# Altium schematic sheet Rajesh_Jasti_17978253_Lab1.SchDoc
size A; DrawnBy: Rajesh_Jasti; Revision: Prototype; SheetNumber: 1; SheetTotal: 1
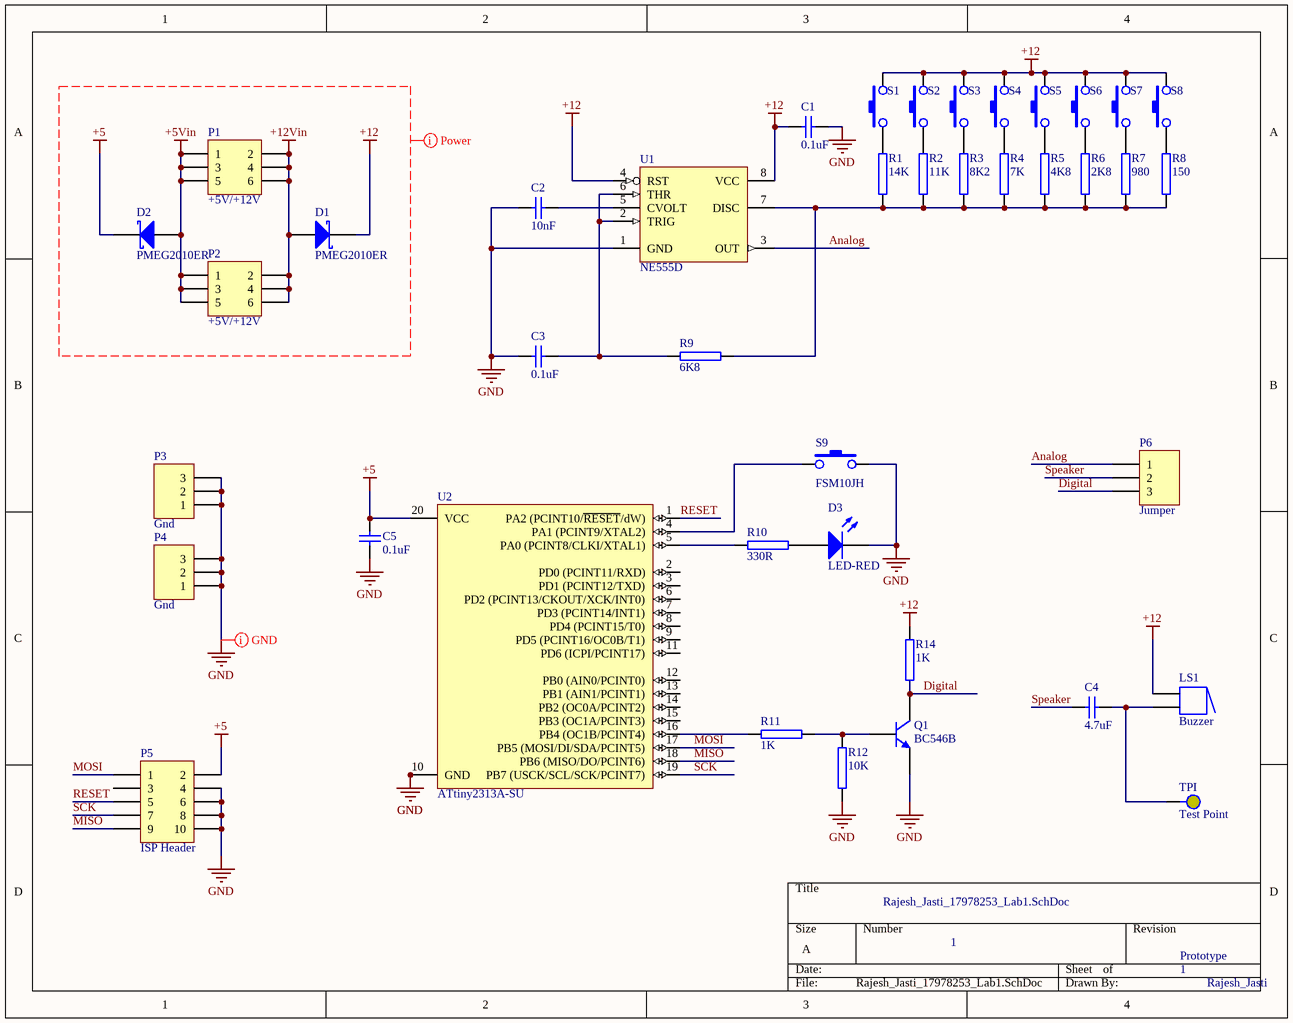
[diagram p0: Rajesh_Jasti_17978253_Lab1.SchDoc]

## Parts
C1  0.1uF  [CAP_1206]
C2  10nF  [CAP_1206]
C3  0.1uF  [CAP_1206]
C4  4.7uF  [CAP_1206]
C5  0.1uF  [CAP_1206]
D1  PMEG2010ER  [SOD123W]
D2  PMEG2010ER  [SOD123W]
D3  LED-RED  [LED1206R]
LS1  Buzzer  [Buzzer]
P1  +5V/+12V  [HDR2X3_AUT]
P2  +5V/+12V  [HDR2X3_AUT]
P3  Gnd  [HDR1X3_AUT]
P4  Gnd  [HDR1X3_AUT]
P5  ISP Header  [FKV10SN_AUT]
P6  Jumper  [HDR1X3_AUT]
Q1  BC546B  [TO-92AUT]
R1  14K  [AXIAL-0.3AUT]
R2  11K  [AXIAL-0.3AUT]
R3  8K2  [AXIAL-0.3AUT]
R4  7K  [AXIAL-0.3AUT]
R5  4K8  [AXIAL-0.3AUT]
R6  2K8  [AXIAL-0.3AUT]
R7  980  [AXIAL-0.3AUT]
R8  150  [AXIAL-0.3AUT]
R9  6K8  [AXIAL-0.3AUT]
R10  330R  [AXIAL-0.3AUT]
R11  1K  [AXIAL-0.3AUT]
R12  10K  [AXIAL-0.3AUT]
R14  1K  [AXIAL-0.3AUT]
S1  FSM10JH  [FSM10JH]  (value not drawn)
S2  FSM10JH  [FSM10JH]  (value not drawn)
S3  FSM10JH  [FSM10JH]  (value not drawn)
S4  FSM10JH  [FSM10JH]  (value not drawn)
S5  FSM10JH  [FSM10JH]  (value not drawn)
S6  FSM10JH  [FSM10JH]  (value not drawn)
S7  FSM10JH  [FSM10JH]  (value not drawn)
S8  FSM10JH  [FSM10JH]  (value not drawn)
S9  FSM10JH  [FSM10JH]
TPI  Test Point  [PAD1_AUT]
U1  NE555D  [SO8_M]
U2  ATtiny2313A-SU  [20S_M]

## Nets
+5: C5.2 D2.1(K) P5.2 U2.20(VCC)
+5Vin: D2.2(A) P1.1 P1.3 P1.5 P2.1 P2.3 P2.5
+12: C1.1 D1.1(K) LS1.1 R14.2 S1.2 S2.2 S3.2 S4.2 S5.2 S6.2 S7.2 S8.2 U1.4(RST) U1.8(VCC)
+12Vin: D1.2(A) P1.2 P1.4 P1.6 P2.2 P2.4 P2.6
GND: C1.2 C2.1 C3.1 C5.1 D3.K P3.1 P3.2 P3.3 P4.1 P4.2 P4.3 P5.4 P5.6 P5.8 P5.10 Q1.3(E) R12.1 S9.2 U1.1(GND) U2.10(GND)
Analog: P6.1 U1.3(OUT)
Digital: P6.3 Q1.1(C) R14.1
MISO: P5.9 U2.18(PB6_(MISO/DO/PCINT6))
MOSI: P5.1 U2.17(PB5_(MOSI/DI/SDA/PCINT5))
RESET: P5.5 U2.1(PA2_(PCINT10/~{RESET}/dW))
SCK: P5.7 U2.19(PB7_(USCK/SCL/SCK/PCINT7))
Speaker: C4.1 P6.2
NetC2_2: C2.2 U1.5(CVOLT)
NetC3_2: C3.2 R9.2 U1.2(TRIG) U1.6(THR)
NetC4_2: C4.2 LS1.2 TPI.1
NetD3_A: D3.A R10.1
NetQ1_2: Q1.2(B) R11.1 R12.2
NetR1_1: R1.1 R2.1 R3.1 R4.1 R5.1 R6.1 R7.1 R8.1 R9.1 U1.7(DISC)
NetR1_2: R1.2 S1.1
NetR2_2: R2.2 S2.1
NetR3_2: R3.2 S3.1
NetR4_2: R4.2 S4.1
NetR5_2: R5.2 S5.1
NetR6_2: R6.2 S6.1
NetR7_2: R7.2 S7.1
NetR8_2: R8.2 S8.1
NetR10_2: R10.2 U2.5(PA0_(PCINT8/CLKI/XTAL1))
NetR11_2: R11.2 U2.16(PB4_(OC1B/PCINT4))
NetS9_1: S9.1 U2.4(PA1_(PCINT9/XTAL2))

Not connected (* = marked no-connect by the designer): P5 3; U2 2(PD0_(PCINT11/RXD)) 3(PD1_(PCINT12/TXD)) 6(PD2_(PCINT13/CKOUT/XCK/INT0)) 7(PD3_(PCINT14/INT1)) 8(PD4_(PCINT15/T0)) 9(PD5_(PCINT16/OC0B/T1)) 11(PD6_(ICPI/PCINT17)) 12(PB0_(AIN0/PCINT0)) 13(PB1_(AIN1/PCINT1)) 14(PB2_(OC0A/PCINT2)) 15(PB3_(OC1A/PCINT3))

## Layout directives
rule Clearance Constraint [Clearance = 20mil]; rule Width Constraint [Pref Width = 80mil    Min Width = 30mil    Max Width = 80mil]; rule Routing Via Style [Pref Size = 50mil    Pref Hole Size = 28mil]: +5, +5Vin, +12, +12Vin
mark named GND: GND

## Library data of the parts
C1-C5 = CAPN 1206: Non Polarized Capacitor, SMD, 1206
D1 D2 = PMEG2010ER: Schottky REC, 20V, 1A, 340mV, SMD SOD123W; Supplier 1: Element14; Supplier Part Number 1: 1907681
D3 = SMD 1206 LED-RED: RED LED, Case 1206; Supplier 1: Farnell; Supplier Part Number 1: 8530017
LS1 = Buzzer: Magnetic Transducer Buzzer; Supplier 1: Farnell; Supplier Part Number 1: 1756516
P1 P2 = HDR3X2: Header, 3-Pin, Dual row, 2.54mm Pitch, Straight; Supplier 1: Farnell; Supplier Part Number 1: 9733574
P3 P4 P6 = HDR1X3V: Header, Plug, 2.54mm, 3 Pins, Straight; Supplier 1: Farnell; Supplier Part Number 1: 9731083
P5 = Box Header 5X2/S: Header, Box, 10 Way, 2.54mm, Straght; Supplier 1: Farnell; Supplier Part Number 1: 8395918
Q1 = BC546B: NPN Bipolar Transistor; 65V, 100mA; Supplier 1: Mouser; Supplier Part Number 1: 512-BC546BTA
R1-R12 R14 = Resistor 1/8W: Resistor, Through Hole, Pitch 300mil
S1-S9 = FSM10JH: Switch, SPST, 0.05A, 12VDC; Supplier 1: Farnell; Supplier Part Number 1: 1555986
TPI = Terminal1: Terminal, Pad 70x70mil, Hole 32 mil
U1 = NE555D: General-Purpose Single Bipolar Timer, SMD; Supplier 1: Farnell; Supplier Part Number 1: 9589880
U2 = ATtiny2313A-SU: 8-bit AVR Microcontroller, 1.8-5.5V, 2KB Flash, 128 Bytes EEPROM, 128 Bytes SRAM; Supplier 1: Farnell; Supplier Part Number 1: 2446406